# Altium schematic sheet SOLENOID-SSR.SchDoc
size D; SheetNumber: 4; SheetTotal: 7
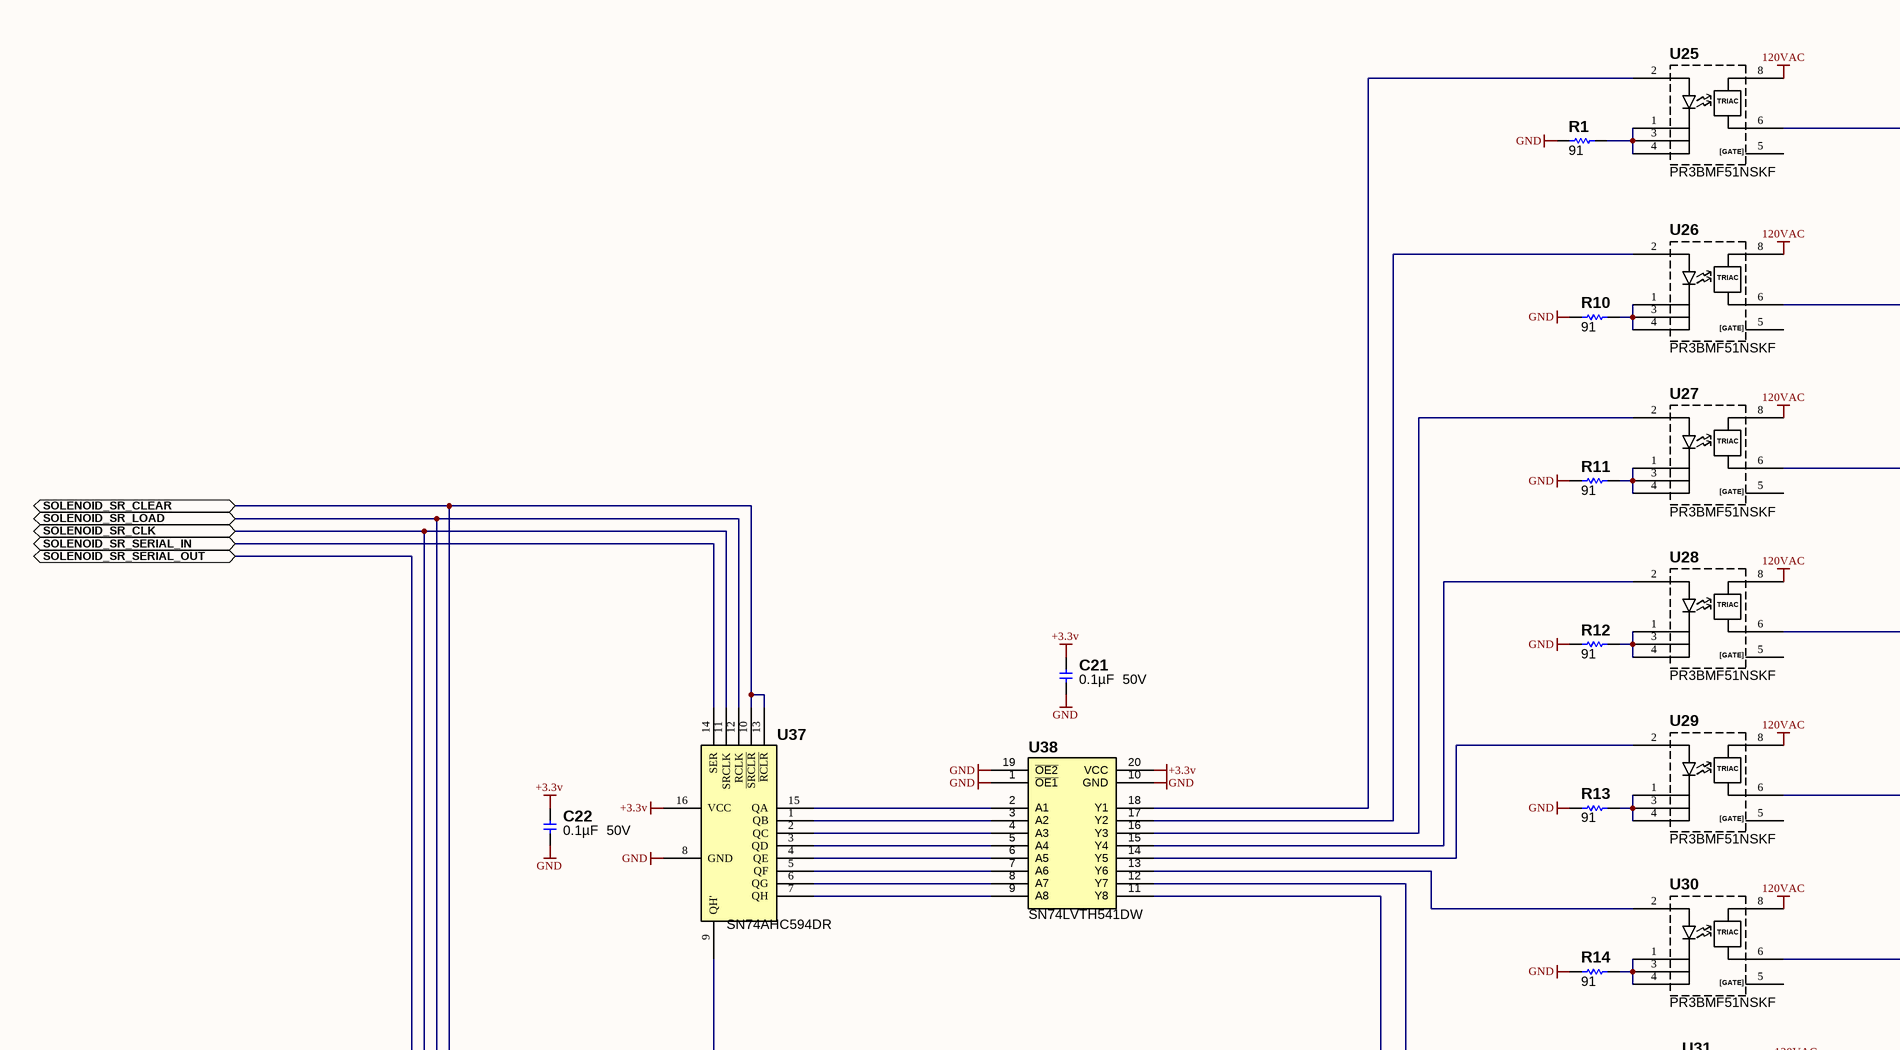
[diagram p0: SOLENOID-SSR.SchDoc, top left]
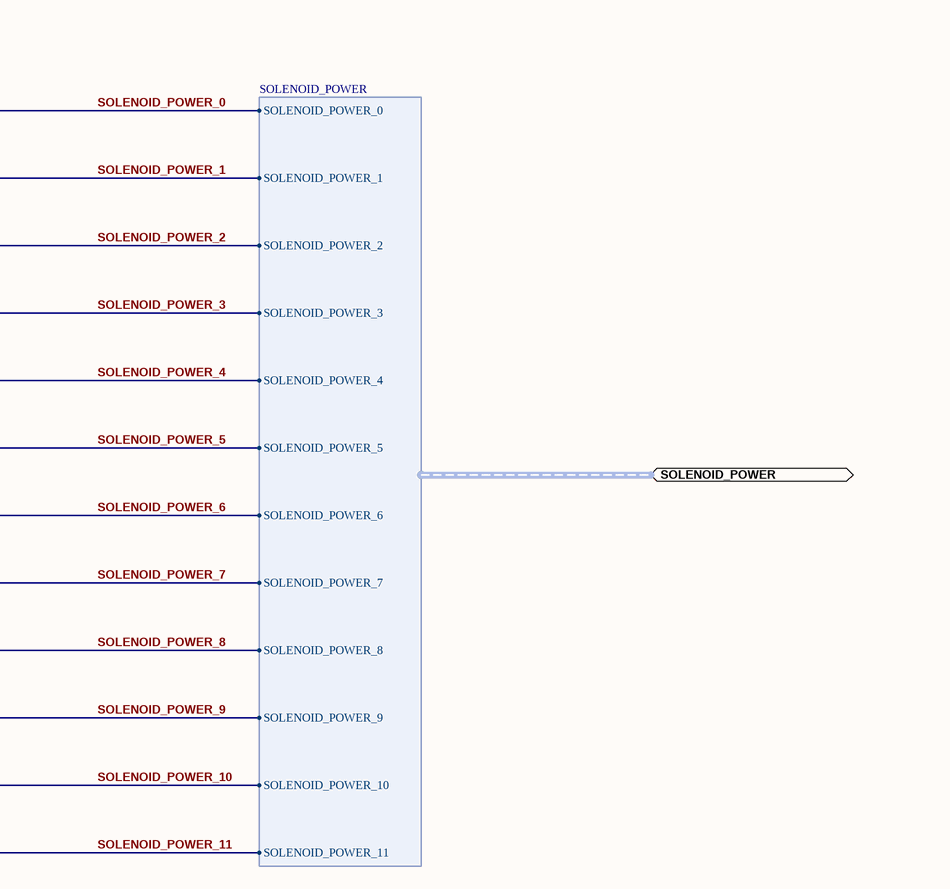
[diagram p1: SOLENOID-SSR.SchDoc, top right]
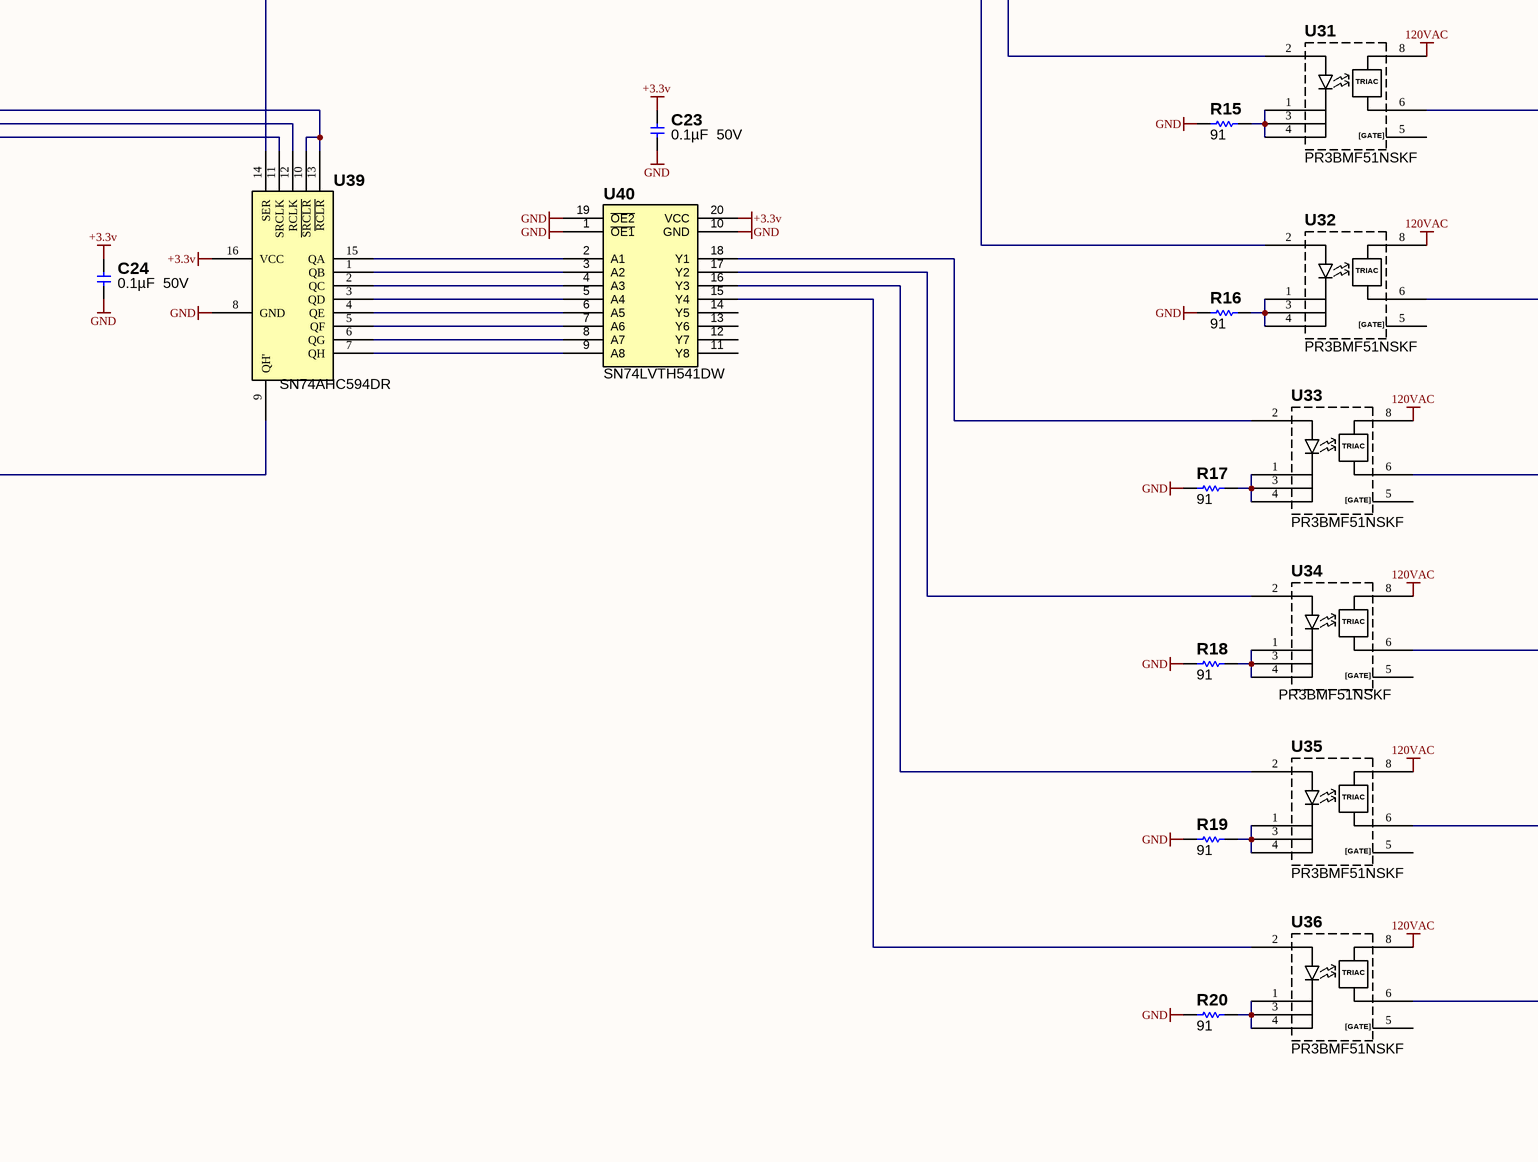
[diagram p2: SOLENOID-SSR.SchDoc, bottom left]
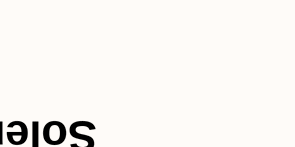
[diagram p3: SOLENOID-SSR.SchDoc, bottom right]

## Parts
C21  0.1µF  50V  [C0805_LD]
C22  0.1µF  50V  [C0805_LD]
C23  0.1µF  50V  [C0805_LD]
C24  0.1µF  50V  [C0805_LD]
R1  91  [R0805_LD]
R10  91  [R0805_LD]
R11  91  [R0805_LD]
R12  91  [R0805_LD]
R13  91  [R0805_LD]
R14  91  [R0805_LD]
R15  91  [R0805_LD]
R16  91  [R0805_LD]
R17  91  [R0805_LD]
R18  91  [R0805_LD]
R19  91  [R0805_LD]
R20  91  [R0805_LD]
U25  PR3BMF51NSKF  [DIP8_NO_PIN7]
U26  PR3BMF51NSKF  [DIP8_NO_PIN7]
U27  PR3BMF51NSKF  [DIP8_NO_PIN7]
U28  PR3BMF51NSKF  [DIP8_NO_PIN7]
U29  PR3BMF51NSKF  [DIP8_NO_PIN7]
U30  PR3BMF51NSKF  [DIP8_NO_PIN7]
U31  PR3BMF51NSKF  [DIP8_NO_PIN7]
U32  PR3BMF51NSKF  [DIP8_NO_PIN7]
U33  PR3BMF51NSKF  [DIP8_NO_PIN7]
U34  PR3BMF51NSKF  [DIP8_NO_PIN7]
U35  PR3BMF51NSKF  [DIP8_NO_PIN7]
U36  PR3BMF51NSKF  [DIP8_NO_PIN7]
U37  SN74AHC594DR  [SOIC127P600X145-16L]
U38  SN74LVTH541DW  [SOIC127P1030X265-20L]
U39  SN74AHC594DR  [SOIC127P600X145-16L]
U40  SN74LVTH541DW  [SOIC127P1030X265-20L]

## Ports
SOLENOID_POWER (harness SOLENOID_POWER), SOLENOID_SR_CLEAR, SOLENOID_SR_CLK, SOLENOID_SR_LOAD, SOLENOID_SR_SERIAL_IN, SOLENOID_SR_SERIAL_OUT

## Harnesses
SOLENOID_POWER: SOLENOID_POWER_0, SOLENOID_POWER_1, SOLENOID_POWER_2, SOLENOID_POWER_3, SOLENOID_POWER_4, SOLENOID_POWER_5, SOLENOID_POWER_6, SOLENOID_POWER_7, SOLENOID_POWER_8, SOLENOID_POWER_9, SOLENOID_POWER_10, SOLENOID_POWER_11

## Nets
120VAC: U25.8 U26.8 U27.8 U28.8 U29.8 U30.8 U31.8 U32.8 U33.8 U34.8 U35.8 U36.8
+3.3v: C21.2 C22.2 C23.2 C24.2 U37.16(VCC) U38.20(VCC) U39.16(VCC) U40.20(VCC)
GND: C21.1 C22.1 C23.1 C24.1 R1.1 R10.1 R11.1 R12.1 R13.1 R14.1 R15.1 R16.1 R17.1 R18.1 R19.1 R20.1 U37.8(GND) U38.1(~{OE1}) U38.10(GND) U38.19(~{OE2}) U39.8(GND) U40.1(~{OE1}) U40.10(GND) U40.19(~{OE2})
SOLENOID_POWER_0: U25.6 ; port SOLENOID_POWER.SOLENOID_POWER_0
SOLENOID_POWER_1: U26.6 ; port SOLENOID_POWER.SOLENOID_POWER_1
SOLENOID_POWER_2: U27.6 ; port SOLENOID_POWER.SOLENOID_POWER_2
SOLENOID_POWER_3: U28.6 ; port SOLENOID_POWER.SOLENOID_POWER_3
SOLENOID_POWER_4: U29.6 ; port SOLENOID_POWER.SOLENOID_POWER_4
SOLENOID_POWER_5: U30.6 ; port SOLENOID_POWER.SOLENOID_POWER_5
SOLENOID_POWER_6: U31.6 ; port SOLENOID_POWER.SOLENOID_POWER_6
SOLENOID_POWER_7: U32.6 ; port SOLENOID_POWER.SOLENOID_POWER_7
SOLENOID_POWER_8: U33.6 ; port SOLENOID_POWER.SOLENOID_POWER_8
SOLENOID_POWER_9: U34.6 ; port SOLENOID_POWER.SOLENOID_POWER_9
SOLENOID_POWER_10: U35.6 ; port SOLENOID_POWER.SOLENOID_POWER_10
SOLENOID_POWER_11: U36.6 ; port SOLENOID_POWER.SOLENOID_POWER_11
SOLENOID_SR_CLEAR: U37.10(~{SRCLR}) U37.13(~{RCLR}) U39.10(~{SRCLR}) U39.13(~{RCLR}) ; port SOLENOID_SR_CLEAR
SOLENOID_SR_CLK: U37.11(SRCLK) U39.11(SRCLK) ; port SOLENOID_SR_CLK
SOLENOID_SR_LOAD: U37.12(RCLK) U39.12(RCLK) ; port SOLENOID_SR_LOAD
SOLENOID_SR_SERIAL_IN: U37.14(SER) ; port SOLENOID_SR_SERIAL_IN
SOLENOID_SR_SERIAL_OUT: U39.9(QH') ; port SOLENOID_SR_SERIAL_OUT
NetR1_2: R1.2 U25.1 U25.3 U25.4
NetR10_2: R10.2 U26.1 U26.3 U26.4
NetR11_2: R11.2 U27.1 U27.3 U27.4
NetR12_2: R12.2 U28.1 U28.3 U28.4
NetR13_2: R13.2 U29.1 U29.3 U29.4
NetR14_2: R14.2 U30.1 U30.3 U30.4
NetR15_2: R15.2 U31.1 U31.3 U31.4
NetR16_2: R16.2 U32.1 U32.3 U32.4
NetR17_2: R17.2 U33.1 U33.3 U33.4
NetR18_2: R18.2 U34.1 U34.3 U34.4
NetR19_2: R19.2 U35.1 U35.3 U35.4
NetR20_2: R20.2 U36.1 U36.3 U36.4
NetU25_2: U25.2 U38.18(Y1)
NetU26_2: U26.2 U38.17(Y2)
NetU27_2: U27.2 U38.16(Y3)
NetU28_2: U28.2 U38.15(Y4)
NetU29_2: U29.2 U38.14(Y5)
NetU30_2: U30.2 U38.13(Y6)
NetU31_2: U31.2 U38.12(Y7)
NetU32_2: U32.2 U38.11(Y8)
NetU33_2: U33.2 U40.18(Y1)
NetU34_2: U34.2 U40.17(Y2)
NetU35_2: U35.2 U40.16(Y3)
NetU36_2: U36.2 U40.15(Y4)
NetU37_1: U37.1(QB) U38.3(A2)
NetU37_2: U37.2(QC) U38.4(A3)
NetU37_3: U37.3(QD) U38.5(A4)
NetU37_4: U37.4(QE) U38.6(A5)
NetU37_5: U37.5(QF) U38.7(A6)
NetU37_6: U37.6(QG) U38.8(A7)
NetU37_7: U37.7(QH) U38.9(A8)
NetU37_9: U37.9(QH') U39.14(SER)
NetU37_15: U37.15(QA) U38.2(A1)
NetU39_1: U39.1(QB) U40.3(A2)
NetU39_2: U39.2(QC) U40.4(A3)
NetU39_3: U39.3(QD) U40.5(A4)
NetU39_4: U39.4(QE) U40.6(A5)
NetU39_5: U39.5(QF) U40.7(A6)
NetU39_6: U39.6(QG) U40.8(A7)
NetU39_7: U39.7(QH) U40.9(A8)
NetU39_15: U39.15(QA) U40.2(A1)

Not connected (* = marked no-connect by the designer): U25 5; U26 5; U27 5; U28 5; U29 5; U30 5; U31 5; U32 5; U33 5; U34 5; U35 5; U36 5; U40 11(Y8) 12(Y7) 13(Y6) 14(Y5)

## Notes on the sheet
- Solenoid Relays
- -1
- Wavenumber LLC
- 2pl
- Rev:
- Sheet
- of
- (in symbol PR3BMF51NSKF) TRIAC; [GATE]

## Library data of the parts
C21-C24 = GRM21BR71H104KA01L: CAP CER 0.1UF 50V 10% X7R 0805; Manufacturer: Murata Electronics North America; Value: 0.1µF  50V; Temperature Coefficient: X7R; Manufacturer Part Number: GRM21BR71H104KA01L; ComponentLink1Description: \\altium.sil.arl.psu.edu\Libraries\datasheets\Murata Electronics North America\c02e.pdf; ComponentLink1URL: http://search.murata.co.jp/Ceramy/image/img/A01X/G101/ENG/GRM1555C1HR60WA01-01.pdf; ComponentLink2Description: External Datasheet; ComponentLink2URL: http://www.murata.com/products/catalog/pdf/c02e.pdf; Stocked: 0; Supplier 1: Digi-Key; Supplier Part Number 1: 490-1666-1-ND; Category: Capacitors; Sort Value: 100000; Sort Value Package: 0805_100000; Pricing: 1 = 0.1  ;  10 = 0.046  ;  50 = 0.0248  ;  100 = 0.0209  ;  250 = 0.01712  ;  500 = 0.01464  ;  1000 = 0.0114 (USD); Sales Status: Active; Capacitance: 0.1µF; Voltage - Rated: 50V; Tolerance: ±10%; Mounting Type: Surface Mount- MLCC; Operating Temperature: -55°C ~ 125°C; Applications: General Purpose; Ratings: -; Package / Case: 0805 (2012 Metric); Size / Dimension: 0.079" L x 0.049" W (2.00mm x 1.25mm); Height - Seated (Max): -; Thickness (Max): 0.053" (1.35mm); Lead Spacing: -; Features: -; Packaging: Cut Tape (CT); Lead Style: -; Package: 0805; Thickness: 135
R1 R10-R20 = ERJ-6ENF91R0V: RES 91 OHM 1/8W 1% 0805 SMD; Manufacturer: Panasonic Electronic Components; Package Power: 0805  (0.125W); Power (Watts): 0.125W- 1/8W; Temperature Coefficient: ±100ppm/°C; Limiting Element Voltage: 150; Maximum Overload Voltage: 200; Maximum Working Voltage: 3.4V; Value: 91; Manufacturer Part Number: ERJ-6ENF91R0V; ComponentLink1Description: Internal Datasheet; ComponentLink1URL: \\altium.sil.arl.psu.edu\Libraries\datasheets\Panasonic Electronic Components\AOA0000CE2.pdf; ComponentLink2Description: External Datasheet; ComponentLink2URL: http://industrial.panasonic.com/www-data/pdf/AOA0000/AOA0000CE2.pdf; Stocked: 0; Supplier 1: Digi-Key; Supplier Part Number 1: P91.0CCT-ND; Category: Resistors; Resistance (Ohms): 91; Composition: Thick Film; Features: -; Tolerance: ±1%; Package / Case: 0805 (2012 Metric); Footprint: 805; Size / Dimension: 0.079" L x 0.049" W (2.00mm x 1.25mm); Height: 0.028" (0.70mm); Number of Terminations: 2; Packaging: Cut Tape (CT); Sort Value: 91; Sort Value Package: 805_91
U25-U36 = PR3BMF51NSKF: RELAY SSR 10MA 240V 1.2A 8-DIP; Manufacturer: Sharp Microelectronics; Circuit: SPST-NO (1 Form A); Output Type: AC; Voltage - Input: 1.2VDC; Voltage - Load: 0 ~ 240 V; Supplier 1: Digi-Key; Supplier Part Number 1: 425-2562-5-ND; Manufacturer Part Number: PR3BMF51NSKF; RoHS: RoHS Compliant; Category: Relays; Stock 1: 973; Pricing 1: 1=1.38, 10=1.1, 25=1.0452, 100=0.9075, 500=0.7975, 750=0.75351, 1000=0.715, 2500=0.6875, 5000=0.671 (USD); Mounting Type: Through Hole; ComponentLink1URL: http://www.sharpsma.com/webfm_send/1389; ComponentLink1Description: http://www.sharpsma.com/webfm_send/1389; Value: PR3BMF51NSKF; Packaging: Tube; On-State Resistance: -; Load Current: 1.2A; Termination Style: PC Pin; Package / Case: 8-DIP (0.300", 7.62mm), 7 Leads; Supplier Device Package: 8-DIP; Relay Type: Relay
U37 U39 = SN74AHC594DR: IC SHIFT REGISTER 8BIT 16-SOIC; Manufacturer: Texas Instruments; Output Type: Standard; Number of Elements: 1; Number of Bits per Element: 8; Function: Serial to Parallel; Voltage - Supply: 2 V ~ 5.5 V; Supplier 1: Digi-Key; Manufacturer Part Number: SN74AHC594DR; RoHS: RoHS Compliant; Category: Integrated Circuits (ICs); Stock 1: 1808; Pricing 1: 1=0.59, 10=0.494, 25=0.4332, 100=0.3708, 250=0.3216, 500=0.2724, 1000=0.21 (USD); Packaging: Cut Tape (CT); Logic Type: Shift Register; Operating Temperature: -40°C ~ 85°C; Mounting Type: Surface Mount; Package / Case: 16-SOIC (0.154", 3.90mm Width); Supplier Device Package: 16-SOIC N; ComponentLink1URL: http://www.ti.com/lit/ds/symlink/sn74ahc594.pdf; ComponentLink1Description: http://www.ti.com/lit/ds/symlink/sn74ahc594.pdf; Supplier Part Number 1: 296-31743-1-ND; Value: SN74AHC594DR
U38 U40 = SN74LVTH541DW: IC BUFF/DVR TRI-ST 8BIT 20SOIC; Manufacturer: Texas Instruments; Logic Type: Buffer/Line Driver, Non-Inverting; Number of Elements: 1; Number of Bits per Element: 8; Current - Output High, Low: 32mA, 64mA; Voltage - Supply: 2.7 V ~ 3.6 V; Value: SN74LVTH541DW; Supplier 1: Digi-Key; Supplier Part Number 1: 296-8728-5-ND; Manufacturer Part Number: SN74LVTH541DW; RoHS: RoHS Compliant; Category: Integrated Circuits (ICs); Stock 1: 8053; Pricing 1: 1=2.02, 25=1.6252, 100=1.4625, 250=1.3, 500=1.1375, 1000=0.9425, 2500=0.8775, 5000=0.845, 10000=0.8125 (USD); Packaging: Tube; Operating Temperature: -40°C ~ 85°C; Mounting Type: Surface Mount; Package / Case: 20-SOIC (0.295", 7.50mm Width); Supplier Device Package: 20-SOIC; ComponentLink1URL: http://www.ti.com/lit/ds/symlink/sn74lvth541.pdf; ComponentLink1Description: http://www.ti.com/lit/ds/symlink/sn74lvth541.pdf